# Altium project 2026MM.PrjPcb (part 5 of 10)
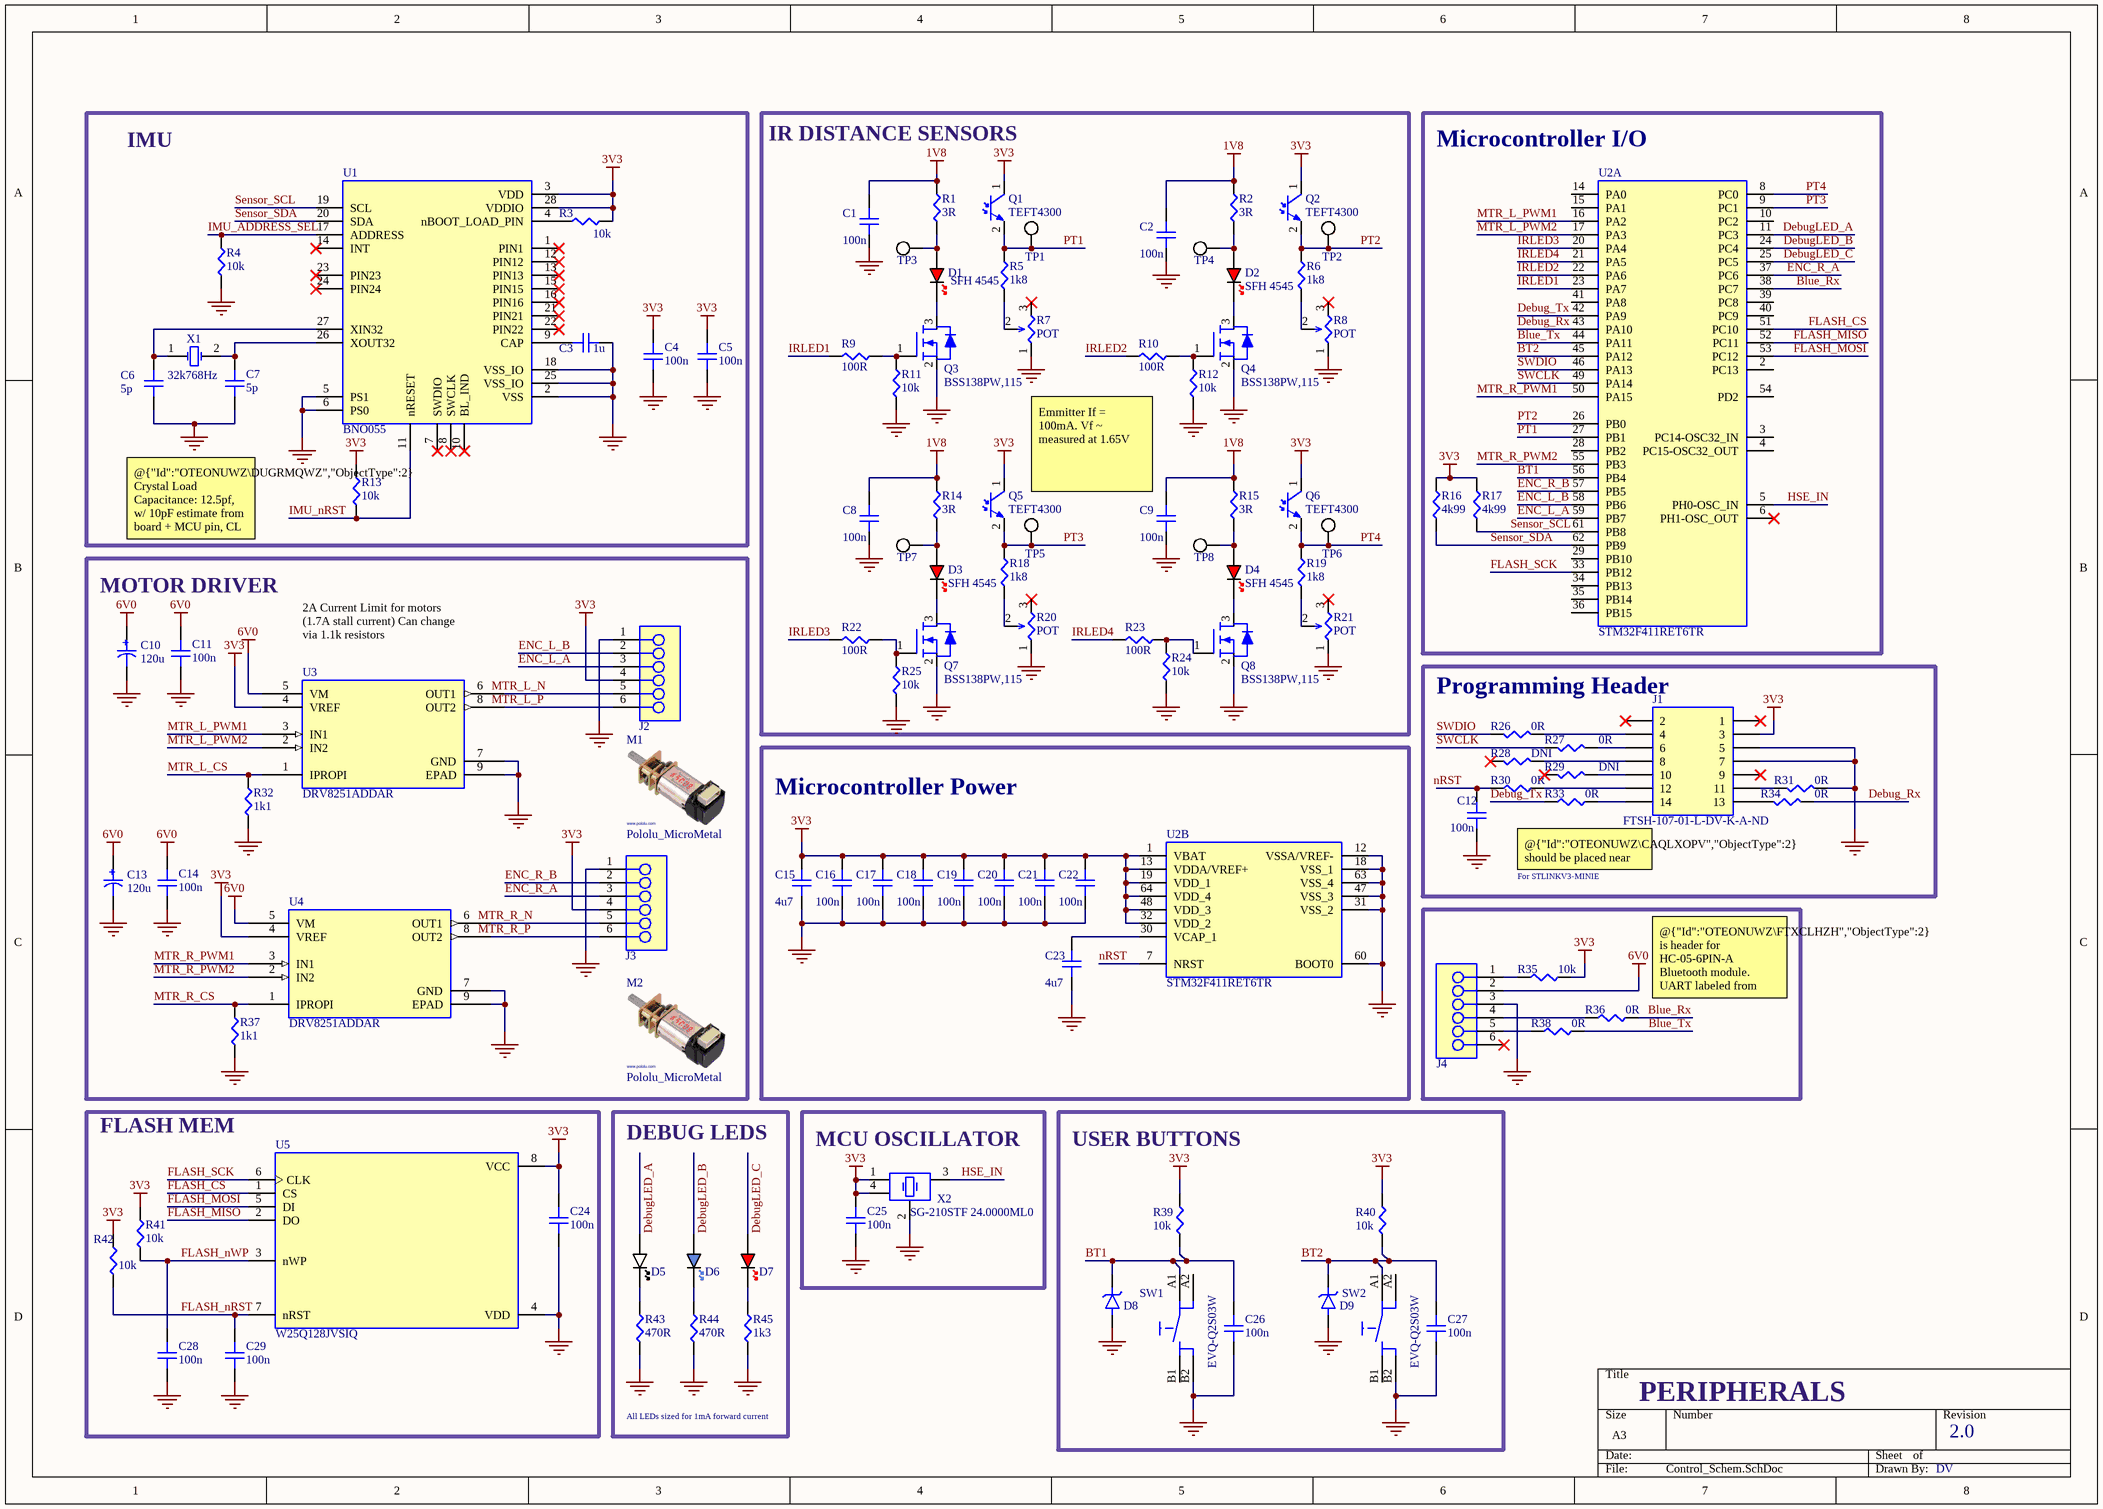
[diagram p5: Control_Schem.SchDoc]

## Sheet Control_Schem.SchDoc (continued)

### Library data of the parts (continued)
X2 = XTAL-4P: Oscillator XO 24MHz ±50ppm 15pF CMOS 55% 1.8V/2.5V/3.3V 4-Pin SMD T/R; Manufacturer: Epson; Fall Time: 3ns; Low Level Output Current: 6mA; Max Supply Current: 2.2mA; Max Supply Voltage: 3.3V; Min Supply Voltage: 1.6V; Ratings: IATF 16949; Supplier 1: Future Electronics; Supplier Part Number 1: SG-210STF 24.0000ML0; Manufacturer Part Number: SG-210STF 24.0000ML0; RoHS: Compliant; Category: Crystals; Stock: 1000; Pricing: 1000=0.335, 2000=0.325 (USD); Case/Package: SMD/SMT; China RoHS: Compliant; Country of Origin: Japan, Mainland China, Malaysia, Thailand; Export Control Classification Number (ECCN) Code: EAR99; Frequency: 24MHz; Frequency Stability: 50ppm; Height: 889µm; Introduction Date: 2014-01-28; Length: 2.4892mm; Lifecycle Status: Production; Load Capacitance: 15pF; Max Operating Temperature: 85°C; Min Operating Temperature: -40°C; Mounting Technology: Surface Mount; Number of Terminals: 4; Packaging: Tape & Reel (TR); REACH SVHC: Yes; Rise Time: 3ns; Schedule B: 8541600060, 8541600060|8541600060|8541600060|8541600060|8541600060; Width: 2.0066mm; ComponentLink1URL: https://datasheet.octopart.com:443/SG-210STF-24.0000ML0-Epson-datasheet-68297300.pdf?src-supplier=Electro+Sonic; ComponentLink1Description: https://datasheet.octopart.com:443/SG-210STF-24.0000ML0-Epson-datasheet-68297300.pdf?src-supplier=Electro+Sonic; ComponentLink2URL: https://datasheet.octopart.com:443/SG-210STF-24.0000ML0-Epson-datasheet-164319076.pdf?src-supplier=Arrow.cn; ComponentLink2Description: https://datasheet.octopart.com:443/SG-210STF-24.0000ML0-Epson-datasheet-164319076.pdf?src-supplier=Arrow.cn; ComponentLink3URL: https://datasheet.octopart.com:443/SG-210STF24.0000ML0-Epson-datasheet-189100305.pdf?src-supplier=Master+Electronics; ComponentLink3Description: https://datasheet.octopart.com:443/SG-210STF24.0000ML0-Epson-datasheet-189100305.pdf?src-supplier=Master+Electronics; ComponentLink4URL: http://sigma.octopart.com:80/149135108/reach_statement/Epson-SG-210STF-24.0000ML0.pdf?src-supplier=Compliance+Statements; ComponentLink4Description: http://sigma.octopart.com:80/149135108/reach_statement/Epson-SG-210STF-24.0000ML0.pdf?src-supplier=Compliance+Statements; ComponentLink5URL: http://sigma.octopart.com:80/149135109/rohs_statement/Epson-SG-210STF-24.0000ML0.pdf?src-supplier=Compliance+Statements; ComponentLink5Description: http://sigma.octopart.com:80/149135109/rohs_statement/Epson-SG-210STF-24.0000ML0.pdf?src-supplier=Compliance+Statements
J1 = STDC14_DebugConnector: Supplier 1: DigiKey

## Sheet PowerSchem.SchDoc
size A4; SheetNumber: 2; SheetTotal: 2
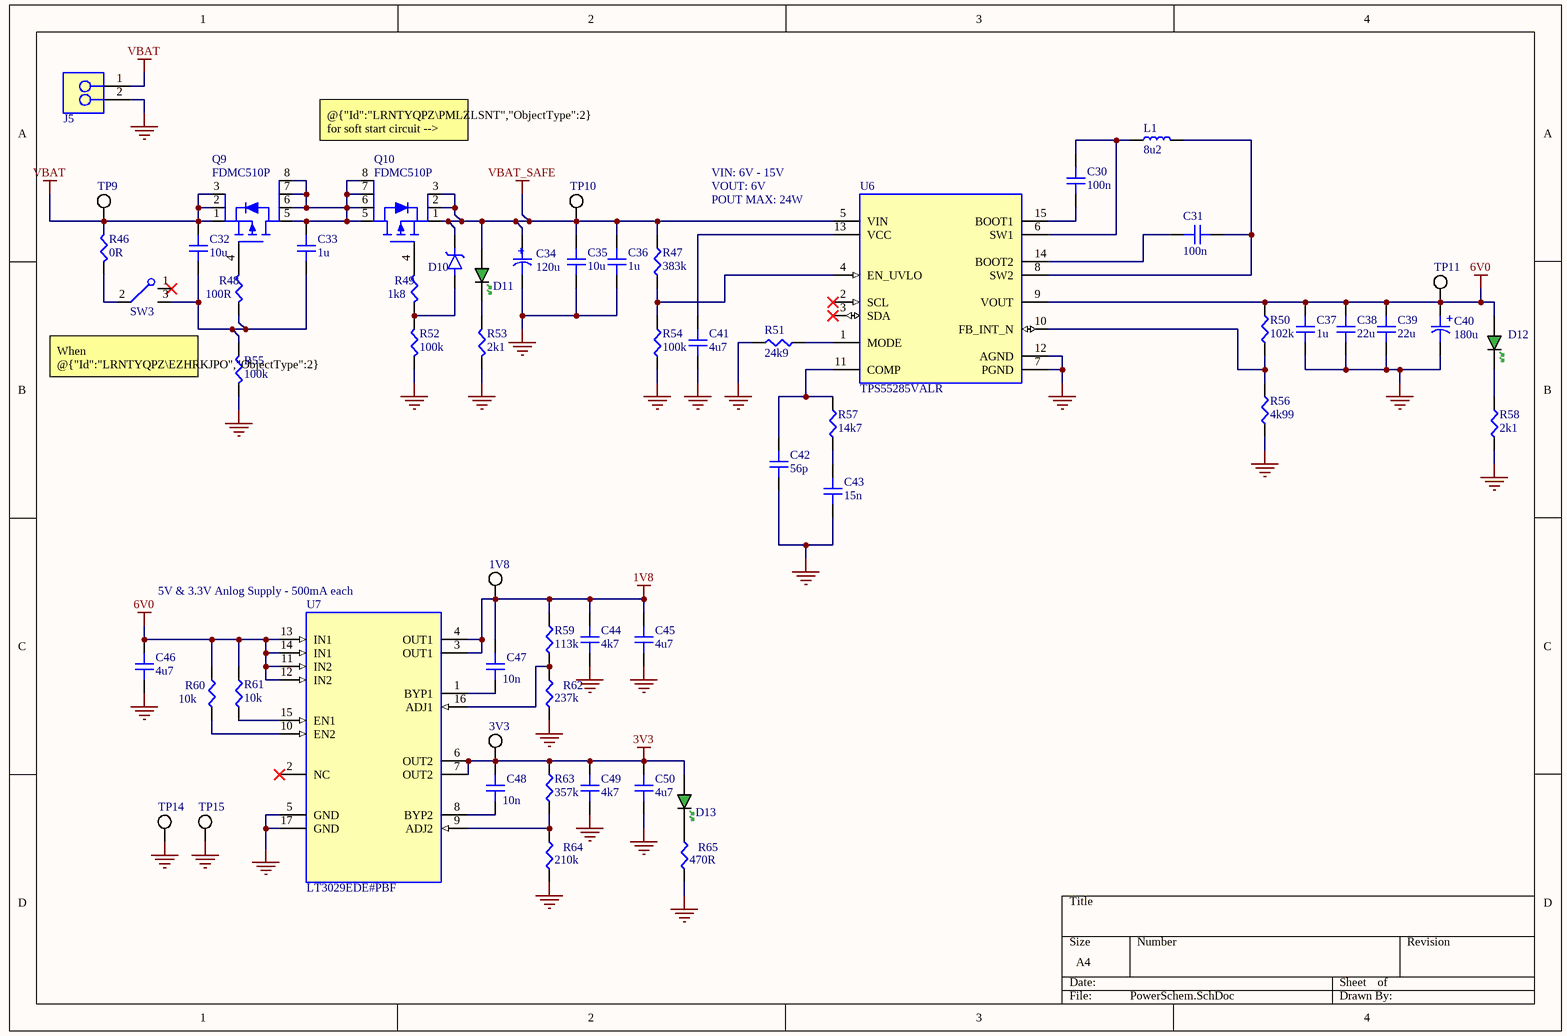
[diagram p1: PowerSchem.SchDoc]

### Parts
C30  100n  [CAP_0603]
C31  100n  [CAP_0603]
C32  10u  [CAP_0805]
C33  1u  [CAP_0603]
C34  120u  [PCAP_SVP_C6_PAN-M]
C35  10u  [CAP_0805]
C36  1u  [CAP_0603]
C37  1u  [CAP_0603]
C38  22u  [CAP_0805]
C39  22u  [CAP_0805]
C40  180u  [PCAP_SVP_C6_PAN-M]
C41  4u7  [CAP_0603]
C42  56p  [CAP_0603]
C43  15n  [CAP_0603]
C44  4k7  [CAP_0603]  (no BOM)
C45  4u7  [CAP_0603]
C46  4u7  [CAP_0603]
C47  10n  [CAP_0603]
C48  10n  [CAP_0603]
C49  4k7  [CAP_0603]  (no BOM)
C50  4u7  [CAP_0603]
D10  65pF  [SOD-923]  (value not drawn)
D11  LED_Green  [LED_0603]  (value not drawn)
D12  LED_Green  [LED_0603]  (value not drawn)
D13  LED_Green  [LED_0603]  (value not drawn)
J5  2POS  [JST_B2B-XH-A]  (value not drawn)
L1  8u2  [IND_SRP1265A-6R8M]
Q9  FDMC510P  [WDFN8_3.3X3.3]
Q10  FDMC510P  [WDFN8_3.3X3.3]
R46  0R  [RES_0603]
R47  383k  [RES_0603]
R48  100R  [RES_0603]
R49  1k8  [RES_0603]
R50  102k  [RES_0603]
R51  24k9  [RES_0603]
R52  100k  [RES_0603]
R53  2k1  [RES_0603]
R54  100k  [RES_0603]
R55  100k  [RES_0603]
R56  4k99  [RES_0603]
R57  14k7  [RES_0603]
R58  2k1  [RES_0603]
R59  113k  [RES_0603]
R60  10k  [RES_0603]
R61  10k  [RES_0603]
R62  237k  [RES_0603]
R63  357k  [RES_0603]
R64  210k  [RES_0603]
R65  470R  [RES_0603]
SW3  SW_SPDT  [OS102011MA1QN1_CNK]  (value not drawn)
TP9  GND  [TP-TH]  (value not drawn)  (no BOM)
TP10  GND  [TP-TH]  (value not drawn)  (no BOM)
TP11  GND  [TP-TH]  (value not drawn)  (no BOM)
TP12  1V8  [TP-TH]  (no BOM)
TP13  3V3  [TP-TH]  (no BOM)
TP14  GND  [TP-TH]  (value not drawn)  (no BOM)
TP15  GND  [TP-TH]  (value not drawn)  (no BOM)
U6  TPS55285VALR  [WQFN-HF(VAL)]
U7  LT3029EDE#PBF  [MSOP-16_MSE]

### Nets
1V8: C44.2 C45.2 C47.2 R59.2 TP12.1 U7.3(OUT1) U7.4(OUT1)
3V3: C48.2 C49.2 C50.2 D13.2(Anode) R63.2 TP13.1 U7.6(OUT2) U7.7(OUT2)
6V0: C37.2 C38.2 C39.2 C40.1 C46.2 D12.2(Anode) R50.2 R60.2 R61.2 TP11.1 U6.9(VOUT) U7.11(IN2) U7.12(IN2) U7.13(IN1) U7.14(IN1)
GND: C34.2 C35.1 C36.1 C37.1 C38.1 C39.1 C40.2 C41.1 C42.1 C43.1 C44.1 C45.1 C46.1 C49.1 C50.1 J5.2 R51.2 R52.1 R53.1 R54.1 R55.1 R56.1 R58.1 R62.1 R64.1 R65.1 TP14.1 TP15.1 U6.7(PGND) U6.12(AGND) U7.5(GND) U7.17(GND)
VBAT: C32.2 J5.1 Q9.1(Source) Q9.2(Source) Q9.3(Source) R46.2 TP9.1
VBAT_SAFE: C34.1 C35.2 C36.2 D10.1 D11.2(Anode) Q10.1(Source) Q10.2(Source) Q10.3(Source) R47.2 TP10.1 U6.5(VIN)
NetC30_1: C30.1 U6.15(BOOT1)
NetC30_2: C30.2 L1.1 U6.6(SW1)
NetC31_1: C31.1 L1.2 U6.8(SW2)
NetC31_2: C31.2 U6.14(BOOT2)
NetC32_1: C32.1 C33.1 R48.1 R55.2 SW3.3
NetC33_2: C33.2 Q9.5(Drain) Q9.6(Drain) Q9.7(Drain) Q9.8(Drain) Q10.5(Drain) Q10.6(Drain) Q10.7(Drain) Q10.8(Drain)
NetC41_2: C41.2 U6.13(VCC)
NetC42_2: C42.2 R57.2 U6.11(COMP)
NetC43_2: C43.2 R57.1
NetC47_1: C47.1 U7.1(BYP1)
NetC48_1: C48.1 U7.8(BYP2)
NetD10_2: D10.2 R49.1 R52.2
NetD11_1: D11.1(Cathode) R53.2
NetD12_1: D12.1(Cathode) R58.2
NetD13_1: D13.1(Cathode) R65.2
NetQ9_4: Q9.4(Gate) R48.2
NetQ10_4: Q10.4(Gate) R49.2
NetR46_1: R46.1 SW3.2
NetR47_1: R47.1 R54.2 U6.4(EN_UVLO)
NetR50_1: R50.1 R56.2 U6.10(FB_INT_N)
NetR51_1: R51.1 U6.1(MODE)
NetR59_1: R59.1 R62.2 U7.16(ADJ1)
NetR60_1: R60.1 U7.10(EN2)
NetR61_1: R61.1 U7.15(EN1)
NetR63_1: R63.1 R64.2 U7.9(ADJ2)

Not connected (* = marked no-connect by the designer): SW3 1*; U6 2(SCL)* 3(SDA)*; U7 2(NC)*

### Notes on the sheet
- @{"Id":"LRNTYQPZ\PMLZLSNT","ObjectType":2} for soft start circuit --> ~200mS startup time
- VIN: 6V - 15V
- VOUT: 6V
- POUT MAX: 24W
- When @{"Id":"LRNTYQPZ\EZHRKJPO","ObjectType":2} depressed, @{"Id":"LRNTYQPZ\PMLZLSNT","ObjectType":2} in off state (Vgs = 0)
- 5V & 3.3V Anlog Supply - 500mA each
- (in symbol CAP_ELECTROLYTIC) +